# EAGLE design NoteBox (EAGLE 7.7.0)
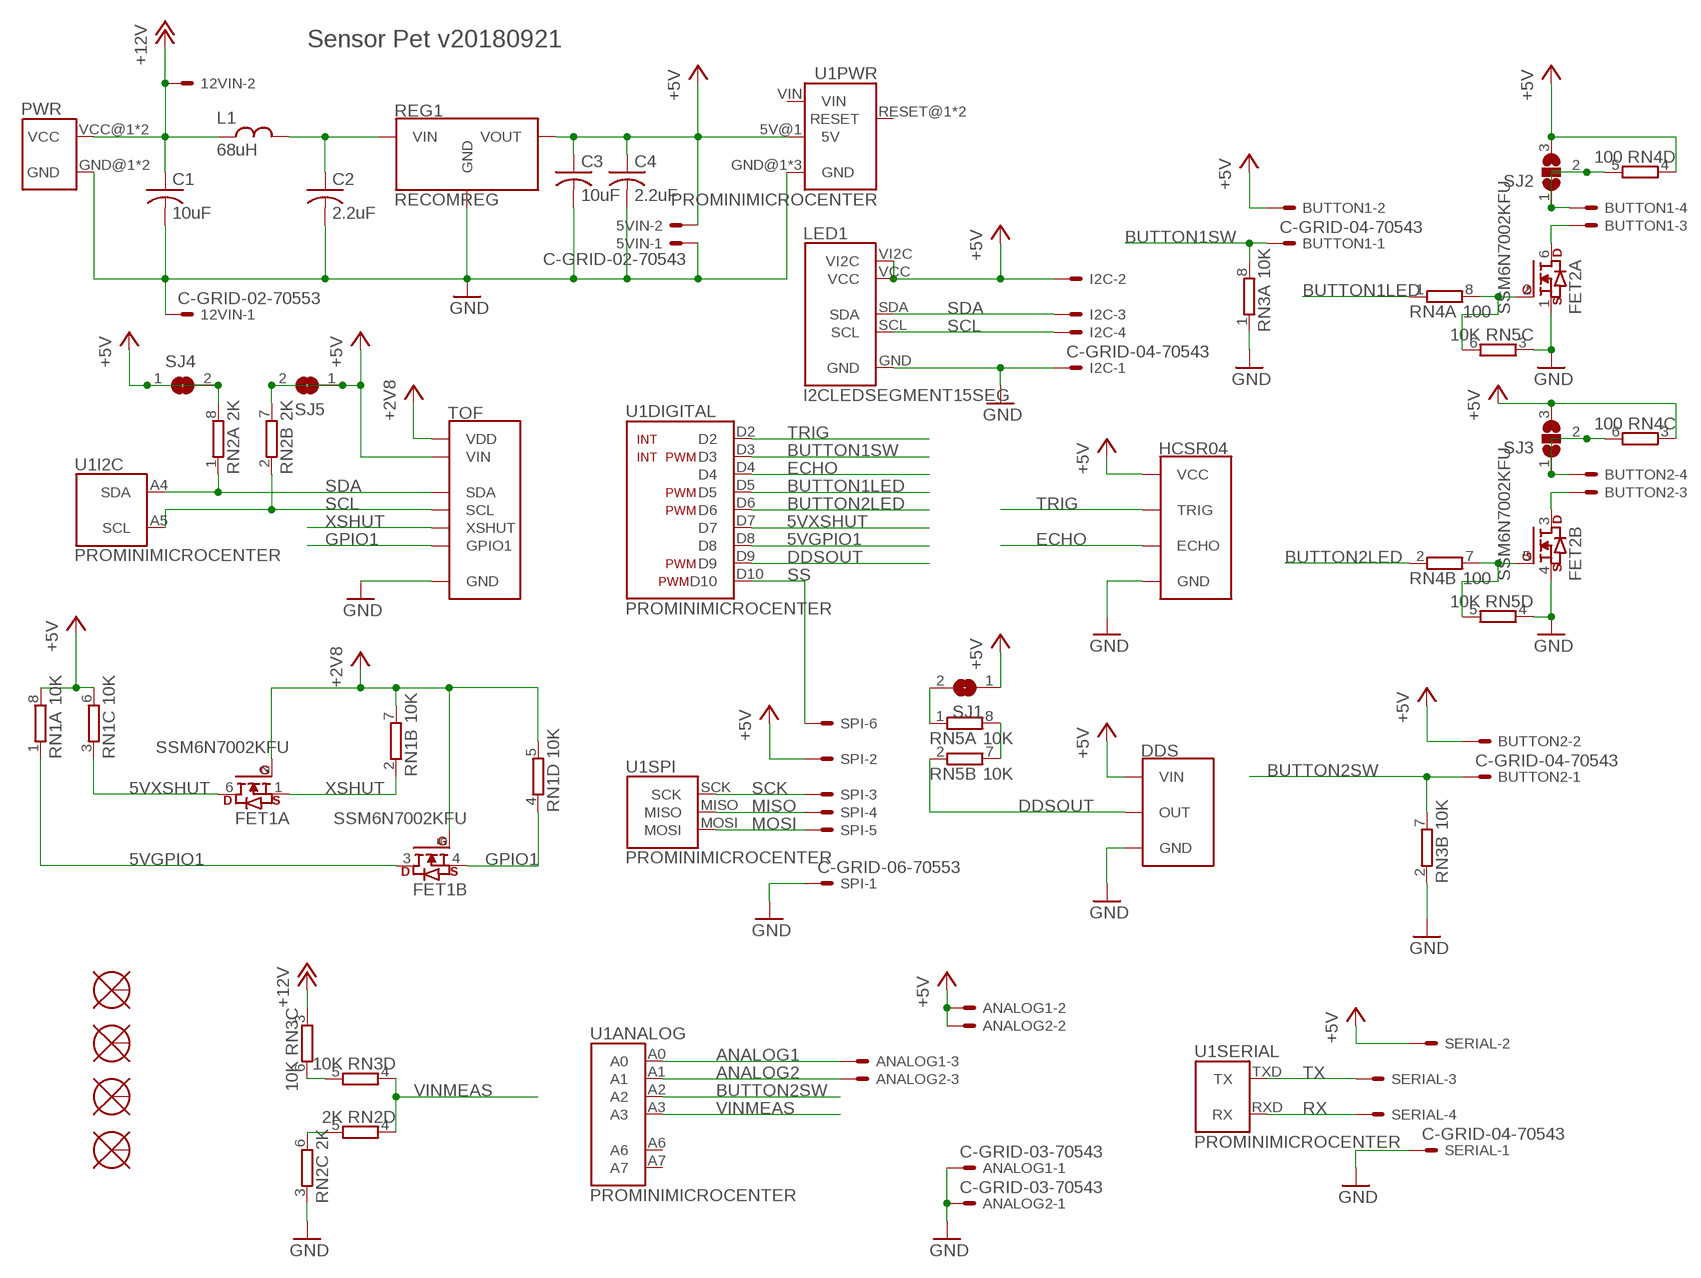
[diagram p0: schematic, sheet 1]

## Parts
5VIN  C-GRID-02-70543  [70543-02]
12VIN  C-GRID-02-70553  [70553-02]
ANALOG1  C-GRID-03-70543  [70543-03]
ANALOG2  C-GRID-03-70543  [70543-03]
BUTTON1  C-GRID-04-70543  [70543-04]
BUTTON2  C-GRID-04-70543  [70543-04]
C1  10uF  C-USC1206K  [C1206K]
C2  2.2uF  C-USC0805K  [C0805K]
C3  10uF  C-USC1206K  [C1206K]
C4  2.2uF  C-USC0805K  [C0805K]
DDS  POLOLUDDS  [POLOLUDDS]
FET1  SSM6N7002KFU  [US6]
FET2  SSM6N7002KFU  [US6]
HCSR04  HCSR04  [HCSR04]
I2C  C-GRID-04-70543  [70543-04]
L1  68uH  INDUCTOR  [6060]
LED1  I2CLEDSEGMENT15SEG  [ADAFRUITI2CLEDSEGMENT]
PWR  POWERPOLERA1X2  [PP-RA-1X2]
REG1  RECOMREG  [RECOMREG]
RN1  10K  4R-NCAY16  [CAY16]
RN2  2K  4R-NCAY16  [CAY16]
RN3  10K  4R-NCAY16  [CAY16]
RN4  100  4R-NCAY16  [CAY16]
RN5  10K  4R-NCAY16  [CAY16]
SERIAL  C-GRID-04-70543  [70543-04]
SJ1  SJ  [SJ]
SJ2  SJ2W  [SJ_2]
SJ3  SJ2W  [SJ_2]
SJ4  SJ  [SJ]
SJ5  SJ  [SJ]
SPI  C-GRID-06-70553  [70553-06]
TOF  POLOLUTOF  [POLOLUTOF]
U1  PROMINIMICROCENTER  [MICROCENTER-ARDUINO-PROMINI]
U$5  MOUNT6-32  [6-32]
U$6  MOUNT6-32  [6-32]
U$7  MOUNT6-32  [6-32]
U$8  MOUNT6-32  [6-32]

## Nets
5VGPIO1: FET1.3(B:D) RN1.1 U1.D8(DIGITAL:D8)
5VXSHUT: FET1.6(A:D) RN1.3 U1.D7(DIGITAL:D7)
+2V8: FET1.2(A:G) FET1.5(B:G) RN1.5 RN1.7 TOF.VDD
+5V: 5VIN.2 ANALOG1.2 ANALOG2.2 BUTTON1.2 BUTTON2.2 C3.1 C4.1 DDS.VIN HCSR04.VCC I2C.2 LED1.VCC LED1.VI2C REG1.3VOUT(VOUT) RN1.6 RN1.8 RN2.7 RN2.8 RN4.3 RN4.4 SERIAL.2 SJ1.1 SJ2.3 SJ3.3 SJ4.1 SJ4.2 SJ5.1 SJ5.2 SPI.2 TOF.VIN U1.5V@1(PWR:5V)
+12V: 12VIN.2 C1.1 L1.P$1 PWR.VCC@1(VCC) PWR.VCC@2(VCC) RN3.3
ANALOG1: ANALOG1.3 U1.A0(ANALOG:A0)
ANALOG2: ANALOG2.3 U1.A1(ANALOG:A1)
B1L+: BUTTON1.4 RN4.5 SJ2.1 SJ2.2
B1L-: BUTTON1.3 FET2.6(A:D)
B2L+: BUTTON2.4 RN4.6 SJ3.1 SJ3.2
B2L-: BUTTON2.3 FET2.3(B:D)
BUTTON1LED: RN4.1 U1.D5(DIGITAL:D5)
BUTTON1SW: BUTTON1.1 RN3.8 U1.D3(DIGITAL:D3)
BUTTON2LED: RN4.2 U1.D6(DIGITAL:D6)
BUTTON2SW: BUTTON2.1 RN3.7 U1.A2(ANALOG:A2)
DDSOUT: DDS.OUT RN5.2 U1.D9(DIGITAL:D9)
ECHO: HCSR04.ECHO U1.D4(DIGITAL:D4)
GND: 5VIN.1 12VIN.1 ANALOG1.1 ANALOG2.1 C1.2 C2.2 C3.2 C4.2 DDS.GND FET2.1(A:S) FET2.4(B:S) HCSR04.GND I2C.1 LED1.GND PWR.GND@1(GND) PWR.GND@2(GND) REG1.2GND(GND) RN2.3 RN3.1 RN3.2 RN5.3 RN5.4 SERIAL.1 SPI.1 TOF.GND U1.GND@1(PWR:GND) U1.GND@2(PWR:GND) U1.GND@3(PWR:GND)
GPIO1: FET1.4(B:S) RN1.4 TOF.GPIO(GPIO1)
MISO: SPI.4 U1.MISO(SPI:MISO)
MOSI: SPI.5 U1.MOSI(SPI:MOSI)
N$1: RN3.5 RN3.6
N$2: C2.1 L1.P$2 REG1.1VIN(VIN)
N$7: RN2.5 RN2.6
N$11: FET2.2(A:G) RN4.8 RN5.6
N$12: FET2.5(B:G) RN4.7 RN5.5
N$13: RN5.1 SJ1.2
N$14: RN5.7 RN5.8
RX: SERIAL.4 U1.RXD(SERIAL:RX)
SCK: SPI.3 U1.SCK(SPI:SCK)
SCL: I2C.4 LED1.SCL RN2.2 TOF.SCL U1.A5(I2C:SCL)
SDA: I2C.3 LED1.SDA RN2.1 TOF.SDA U1.A4(I2C:SDA)
SS: SPI.6 U1.D10(DIGITAL:D10)
TRIG: HCSR04.TRIG U1.D2(DIGITAL:D2)
TX: SERIAL.3 U1.TXD(SERIAL:TX)
VINMEAS: RN2.4 RN3.4 U1.A3(ANALOG:A3)
XSHUT: FET1.1(A:S) RN1.2 TOF.XSHUT
Unconnected: U1.A6(ANALOG:A6) U1.A7(ANALOG:A7) U1.RESET@1(PWR:RESET) U1.RESET@2(PWR:RESET) U$5.P$1 U$6.P$1 U$7.P$1 U$8.P$1

## Notes on the sheet
- Sensor Pet v20180921

## Power pins joined to a net without a drawn wire
VIN: U1.VIN(PWR:VIN)

## Library data of the parts
5VIN 12VIN = con-molex:C-GRID-02: CONNECTOR wire to board 2.54 mm (0.100") pitch header; OC_FARNELL: unknown; OC_NEWARK: unknown
ANALOG1 ANALOG2 = con-molex:C-GRID-03: CONNECTOR wire to board 2.54 mm (0.100") pitch header; OC_FARNELL: unknown; OC_NEWARK: unknown
BUTTON1 BUTTON2 I2C SERIAL = con-molex:C-GRID-04: CONNECTOR wire to board 2.54 mm (0.100") pitch header; OC_FARNELL: unknown; OC_NEWARK: unknown
C1-C4 = rcl:C-US: CAPACITOR, American symbol
DDS = LUR_Components:POLOLUDDS: Pololu Digital Distance Sensors GP2Y0D805 GP2Y0D810 GP2Y0D815
FET1 FET2 = LUR_Components:SSM6N7002KFU: SSM6N7002KFU Dual N Channel MOSFET SC88 US6 TSSOP-6 SOT-363
HCSR04 = LUR_Components:HCSR04: Traditional HC-SR04, HCSR04 sensor
L1 = LUR_Components:INDUCTOR: Murata Wirewound Shielded Inductor 1255AY-680M=P3
LED1 = UltrasonicHarp:I2CLEDSEGMENT: Adafruit I2C LED matrix breakouts Such as seven segment displays, 15 segment displays, etc.
PWR = Anderson:POWERPOLE: Anderson PowerPole Board Connector
REG1 = LUR_Components:RECOMREG: RECOM Switching Regulators R-78E-1.0
RN1-RN5 = resistor-dil:4R-N: Array Chip Resistor Source: RS Component / Phycomp; OC_FARNELL: unknown; OC_NEWARK: unknown
SJ1 SJ4 SJ5 = jumper:SJ: SMD solder JUMPER
SJ2 SJ3 = jumper:SJ2W: SMD solder JUMPER
SPI = con-molex:C-GRID-06: CONNECTOR wire to board 2.54 mm (0.100") pitch header; OC_FARNELL: unknown; OC_NEWARK: unknown
TOF = LUR_Components:POLOLUTOF: Pololu Time of Flight Sensors VL53L1X VL53L0X VL6180X
U1 = UltrasonicHarp:PROMINI: Arduino Pro-Mini
U$5-U$8 = Mounts:MOUNT

## Board
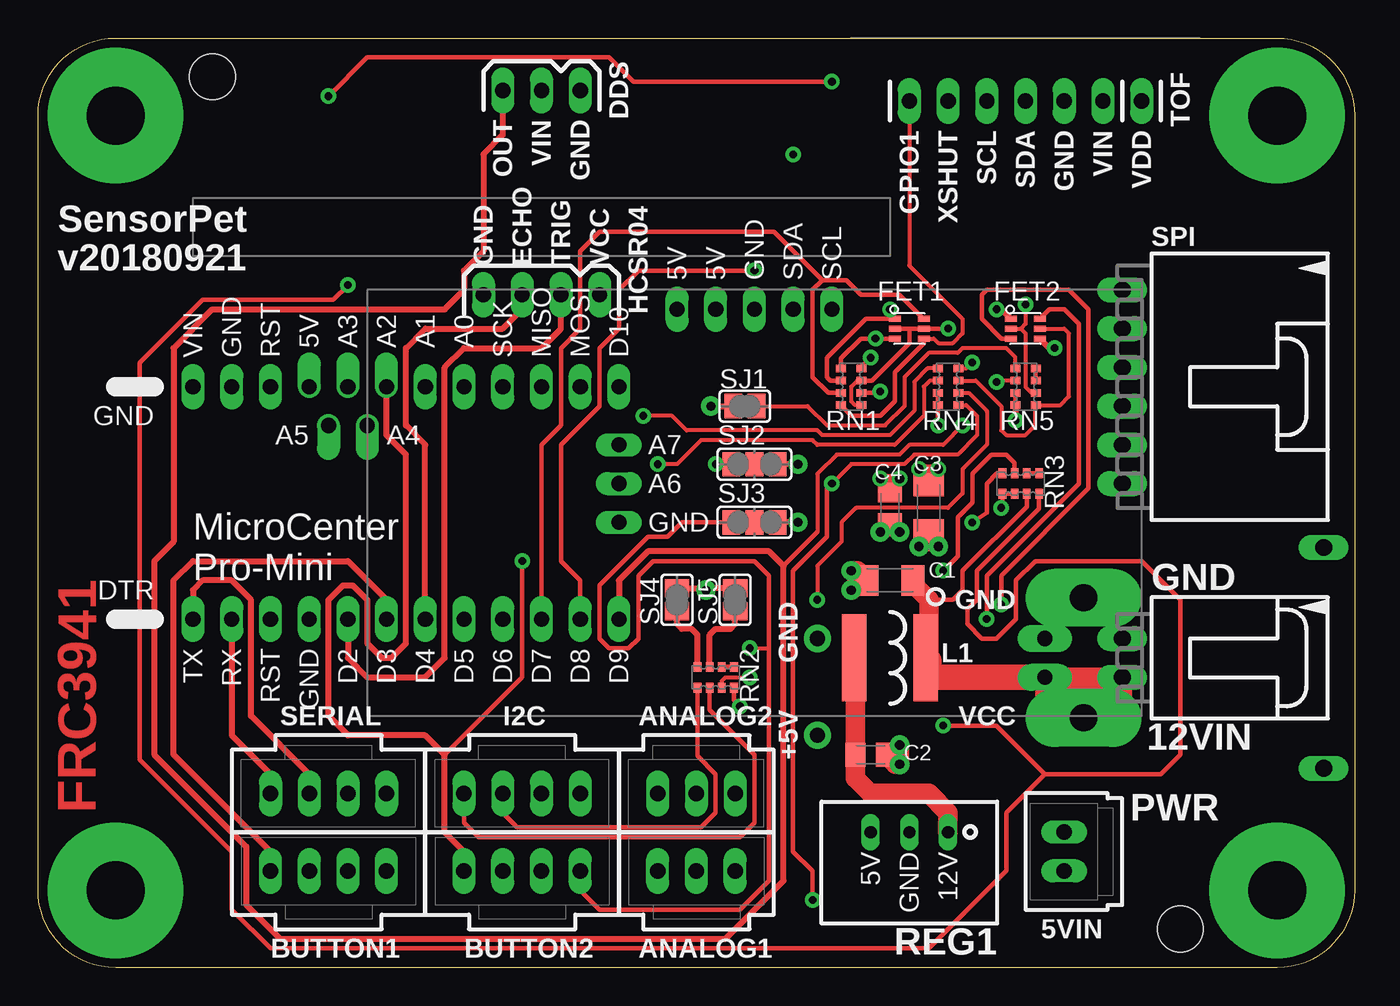
[diagram p1: board, top side]
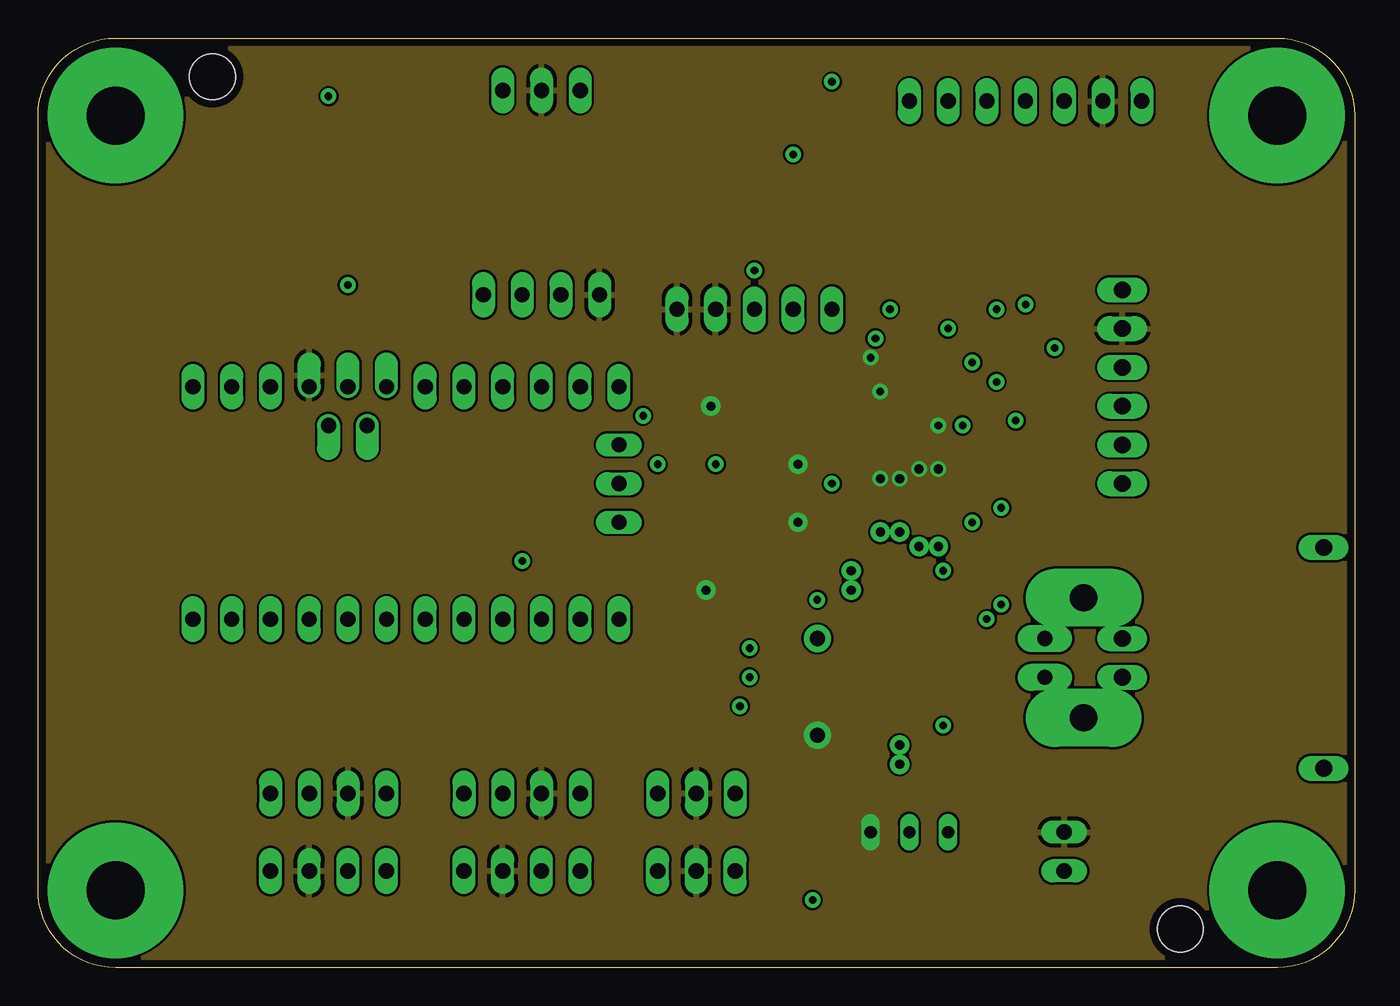
[diagram p2: board, inner layer Route2]
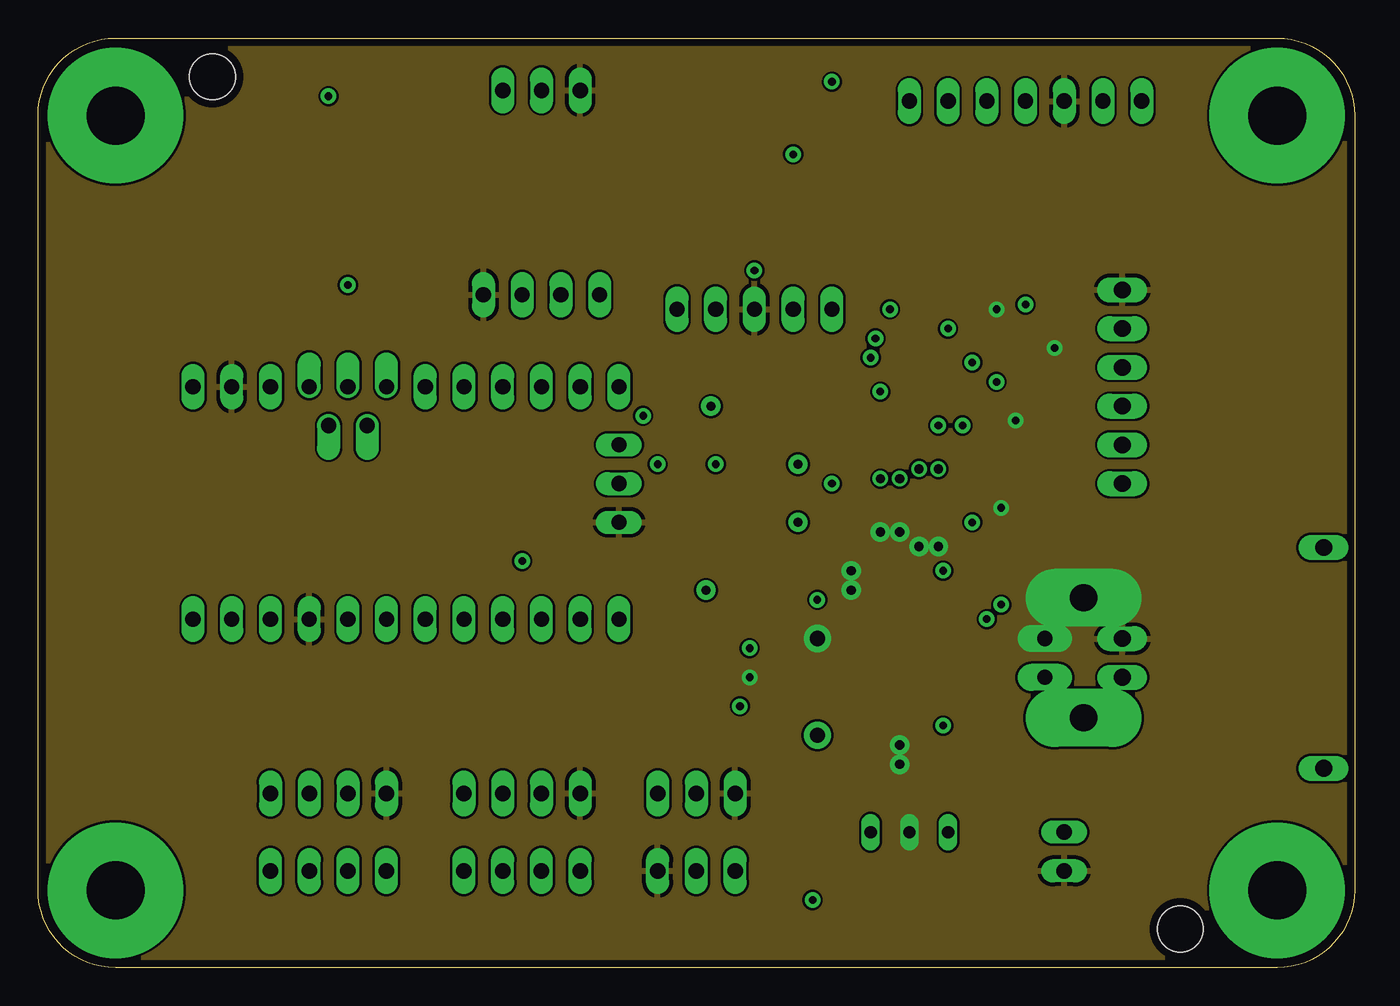
[diagram p3: board, inner layer Route15]
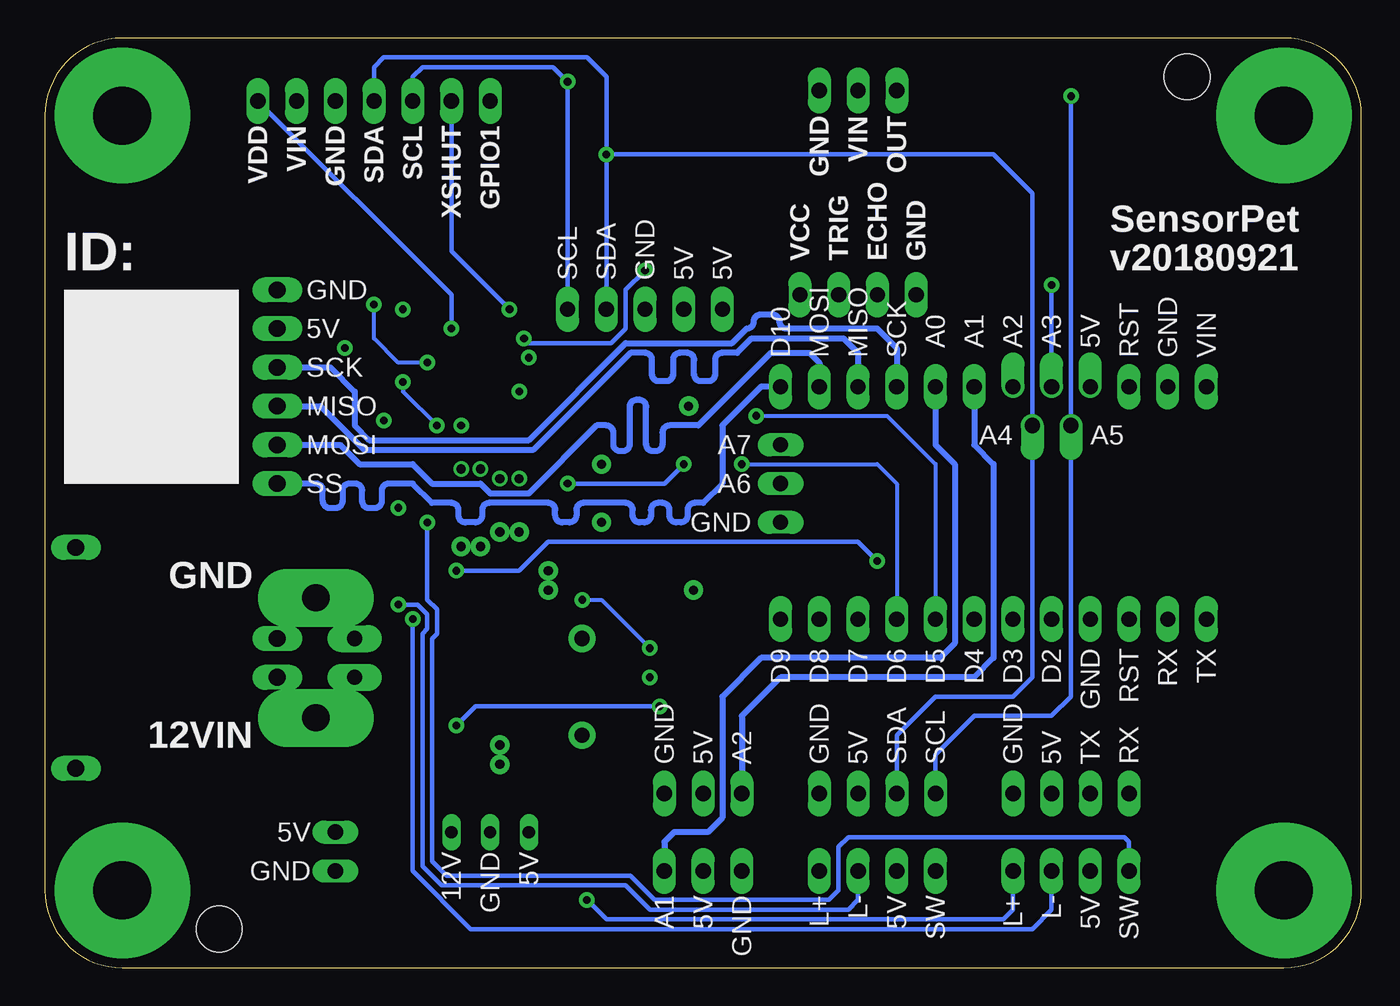
[diagram p4: board, bottom side, seen from below]

Size 86.36 x 60.96 mm. Coordinates in mm from the lower left corner, seen from the top.
Outline: 0,55.88 arc-90 5.08,60.96 81.28,60.96 arc-90 86.36,55.88 86.36,5.08 arc-90 81.28,0 5.08,0 arc-90 0,5.08 0,55.88
Copper layers (1*2*15*16): Top 0.035mm / dielectric 0.2mm / Route2 0.035mm / dielectric 1.2mm / Route15 0.035mm / dielectric 0.2mm / Bottom 0.035mm
Design rules "Elecrow_4-layer_PCB_eagle_rule": minimum track width 6mil, minimum drill 12mil, track to track 6mil, track to pad 6mil, pad to pad 6mil, via to via 8mil, smd to smd 0mil, copper to edge 20mil, drill to drill 10mil, minimum pad ring 6mil, minimum via ring 6mil, stop-mask expansion 0mil, vias tented up to drill 100mil, thermal gap 10mil
Holes 3 mm at 11.43,58.42 74.93,2.54

### Footprints (pad centres in the part's own frame; a part is rotated, then mirrored left to right if it is on the bottom)
70543-02 = drill 1.016 long: 1 -1.27,0; 2 1.27,0
70553-02 = drill 1.092 long: 1 -1.27,-7.62; 2 1.27,-7.62
70543-03 = drill 1.016 long: 1 -2.54,0; 2 0,0; 3 2.54,0
70543-04 = drill 1.016 long: 1 -3.81,0; 2 -1.27,0; 3 1.27,0; 4 3.81,0
C1206K = smd 1.5 x 2: 1 -1.5,0; 2 1.5,0
C0805K = smd 1.3 x 1.6: 1 -1,0; 2 1,0
POLOLUDDS = drill 1 long: GND -0.381,2.54; OUT -0.381,-2.54; VIN -0.381,0
US6 = smd 0.4 x 0.8: 1 -0.65,-0.95; 2 0,-0.95; 3 0.65,-0.95; 4 0.65,0.95; 5 0,0.95; 6 -0.65,0.95
HCSR04 = drill 1 long: ECHO 0.318,-1.27; GND 0.318,-3.81; TRIG 0.318,1.27; VCC 0.318,3.81
6060 = smd 1.6 x 5.7: P$1 -2.35,0; P$2 2.35,0
ADAFRUITI2CLEDSEGMENT = drill 1 long: GND -1.27,0; SCL 3.81,0; SDA 1.27,0; VCC -3.81,0; VI2C -6.35,0
PP-RA-1X2 = drill 1.778 pad 3.81 long: GND@1 0,-3.937; VCC@1 0,3.937 | drill 1 pad 1.778 long: GND@2 2.54,-1.27; VCC@2 2.54,1.27 | drill 1.1 long: STP@1 -15.748,7.239; STP@2 -15.748,-7.239
RECOMREG = drill 0.8 long: 1VIN -2.54,0; 2GND 0,0; 3VOUT 2.54,0
CAY16 = smd 0.5 x 0.65: 1 -1.2,-0.675; 2 -0.4,-0.675; 3 0.4,-0.675; 4 1.2,-0.675; 5 1.2,0.675; 6 0.4,0.675; 7 -0.4,0.675; 8 -1.2,0.675
SJ = smd 1.168 x 1.6: 1 -0.762,0; 2 0.762,0
SJ_2 = smd 1.168 x 1.6: 1 -1.524,0; 2 0,0; 3 1.524,0
70553-06 = drill 1.092 long: 1 -6.35,-7.62; 2 -3.81,-7.62; 3 -1.27,-7.62; 4 1.27,-7.62; 5 3.81,-7.62; 6 6.35,-7.62
POLOLUTOF = drill 1 long: GND 0.318,2.54; GPIO 0.318,-7.62; SCL 0.318,-2.54; SDA 0.318,0; VDD 0.318,7.62; VIN 0.318,5.08; XSHUT 0.318,-5.08
MICROCENTER-ARDUINO-PROMINI = drill 1 offset: 5V@1 -6.35,7.62; A2 -1.27,7.62; A3 -3.81,7.62; A4 -2.54,5.08; A5 -5.08,5.08 | drill 1 long: A0 3.81,7.62; A1 1.27,7.62; A6 13.97,1.27; A7 13.97,3.81; D2 -3.81,-7.62; D3 -1.27,-7.62; D4 1.27,-7.62; D5 3.81,-7.62; D6 6.35,-7.62; D7 8.89,-7.62; D8 11.43,-7.62; D9 13.97,-7.62; D10 13.97,7.62; GND@1 -11.43,7.62; GND@2 13.97,-1.27; GND@3 -6.35,-7.62; MISO 8.89,7.62; MOSI 11.43,7.62; RESET@1 -8.89,7.62; RESET@2 -8.89,-7.62; RXD -11.43,-7.62; SCK 6.35,7.62; TXD -13.97,-7.62; VIN -13.97,7.62
6-32 = drill 3.797 pad 8.89: P$1 0,0

### Placement (x,y rotation side)
5VIN  67.31,7.62 90 top
12VIN  78.74,20.32 270 top
ANALOG1  43.18,6.35 0 top
ANALOG2  43.18,11.43 180 top
BUTTON1  19.05,6.35 0 top
BUTTON2  31.75,6.35 0 top
C1  55.88,25.4 180 top
C2  54.61,13.97 0 top
C3  58.42,30.16 270 top
C4  55.88,30.16 270 top
DDS  33.02,57.15 270 top
FET1  57.15,41.91 270 top
FET2  64.77,41.91 270 top
HCSR04  33.02,44.45 270 top
I2C  31.75,11.43 180 top
L1  55.88,20.32 180 top
LED1  48.26,43.18 0 top
PWR  68.58,20.32 180 top
REG1  57.15,8.89 180 top
RN1  53.34,38.1 270 top
RN2  44.45,19.05 0 top
RN3  64.45,31.75 0 top
RN4  59.69,38.1 270 top
RN5  64.77,38.1 270 top
SERIAL  19.05,11.43 180 top
SJ1  46.35,36.83 0 top
SJ2  46.99,33.02 0 top
SJ3  46.99,29.21 0 top
SJ4  41.91,24.13 90 top
SJ5  45.72,24.13 90 top
SPI  78.74,38.1 270 top
TOF  64.77,57.15 270 top
U1  24.13,30.48 0 top
U$5  5.08,5.08 0 top
U$6  5.08,55.88 0 top
U$7  81.28,55.88 0 top
U$8  81.28,5.08 0 top

### Tracks (layer width: path | path; a pad name or v marks a point on that pad's centre or on a via)
5VGPIO1  (via drill 0.5 pad 1.02)
  Top 0.305: RN1.1 52.66,39.97 53.96,41.26 v54.93,41.26 FET1.3 | U1.D8 35.56,25.4 34.29,26.67 34.29,34.29 36.83,36.83 36.83,40.64 38.1,41.91 38.1,44.45 39.37,45.72 v46.99,45.72
  Bottom 0.305: v46.99,45.72 48.26,44.45 48.26,41.91 49.21,40.96 54.62,40.96 v54.93,41.26
5VXSHUT
  Top 0.305: FET1.6 58.09,42.56 56.52,44.13 53.98,44.13 53.02,45.09 51.44,45.09 | 51.44,45.09 50.8,44.45 50.8,38.73 51.84,37.7 RN1.3 | U1.D7 33.02,34.29 34.29,35.56 34.29,40.64 35.56,41.91 35.56,46.99 36.83,48.26 48.26,48.26 51.44,45.09
+2V8  (via drill 0.5 pad 1.02)
  Top 0.254: RN1.5 53.59,36.9 53.34,37.15 53.34,38.1 53.74,38.5 RN1.7
  Top 0.305: 57.15,41.91 FET1.5 v59.69,41.91 | 57.15,41.91 FET1.2 | RN1.7 54.69,38.5 57.15,40.96 57.15,41.91
  Bottom 0.305: TOF.VDD 59.69,44.13 v59.69,41.91
+5V  (via drill 0.5 pad 1.02, 0.6 pad 1.02, 0.6 pad 1.27, 1 pad 1.78)
  Top 0.305: RN1.8 54.02,39.41 v54.61,40.01 | RN1.6 55.16,37.7 v55.24,37.78 | RN4.4 RN4.3 59.02,36.47 v59.05,35.56
  Top 0.406: v44.13,36.83 SJ1.1 | v49.85,33.02 SJ2.3 | v49.85,29.21 SJ3.3 | RN2.8 43.25,21.84 42.86,22.23 42.23,22.23 41.91,22.54 SJ4.1 SJ4.2 43.69,24.89 v43.81,24.77 43.94,24.89 SJ5.2 SJ5.1 45.72,22.54 45.4,22.23 44.45,22.23 44.05,21.82 RN2.7
  Top 0.61: v55.24,32.07 v56.52,32.07 56.52,32.12 C4.1 | v59.05,32.7 v57.78,32.7 57.78,32.62 C3.1
  other vias: 51.12,15.24
  pour Route2: 0,60.96 86.36,60.96 86.36,0 0,0
+12V
  Top 0.305: 58.42,24.13 60.01,24.13 60.64,24.77 60.64,26.04 64.85,30.25 RN3.3
  Top 1.27: 12VIN.2 71.12,17.78 69.85,16.51 68.71,16.51 PWR.VCC@1 68.45,16.51 67.31,16.51 66.04,17.78 PWR.VCC@2 | PWR.VCC@2 67.31,19.05 68.58,17.78 69.85,19.05 12VIN.2 | 12VIN.2 PWR.VCC@2 | C1.1 57.38,25.17 58.42,24.13 58.42,20.51 L1.P$1
  Top 1.676: PWR.VCC@2 58.42,19.05 58.42,20.13 L1.P$1
ANALOG1
  Bottom 0.406: U1.A0 27.94,34.29 26.67,33.02 26.67,21.27 27.62,20.32 39.37,20.32 41.91,17.78 41.91,9.84 42.86,8.89 45.09,8.89 45.72,8.26 ANALOG1.3
ANALOG2
  Bottom 0.406: U1.A1 25.4,34.29 24.13,33.02 24.13,20.32 25.4,19.05 38.1,19.05 40.64,16.51 ANALOG2.3
B1L+  (via drill 0.5 pad 1.02)
  Top 0.254: RN4.5 60.89,36.9 61.59,36.2 61.59,34.92 60.33,33.66 57.47,33.66 56.83,33.02 53.34,33.02 v52.07,31.75
  Top 0.305: v50.8,4.45 50.8,6.35 49.53,7.62 49.53,26.04 51.75,28.26 51.75,31.43 v52.07,31.75 | v44.45,33.02 SJ2.1
  Top 0.406: SJ2.1 SJ2.2
  Bottom 0.305: BUTTON1.4 22.86,3.81 23.5,3.17 49.53,3.17 v50.8,4.45 | v52.07,31.75 45.72,31.75 v44.45,33.02
B1L-  (via drill 0.5 pad 1.02)
  Top 0.305: FET2.6 66.34,43.18 67.31,43.18 68.26,42.23 68.26,31.75 62.23,25.72 v62.23,22.86
  Bottom 0.305: v62.23,22.86 62.23,6.35 58.42,2.54 21.59,2.54 20.32,3.81 BUTTON1.3
B2L+  (via drill 0.5 pad 1.02)
  Top 0.254: RN4.6 61.04,37.7 62.23,36.51 62.23,34.29 60.64,32.7 60.64,31.11 59.69,30.16 53.66,30.16 52.7,29.21 52.7,27.94 51.12,26.35 v51.12,24.13 | v46.67,20.95 47.94,20.95
  Top 0.305: BUTTON2.4 35.56,5.08 36.83,3.81 46.04,3.81 47.94,5.71 47.94,20.95 47.94,25.72 46.99,26.67 40.32,26.67 39.37,25.72 39.37,21.59 38.73,20.95 37.47,20.95 36.83,21.59 36.83,25.08 40.01,28.26 41.27,28.26 42.23,29.21 SJ3.1
  Top 0.406: SJ3.1 SJ3.2
  Bottom 0.254: v51.12,24.13 49.85,24.13 v46.67,20.95
B2L-  (via drill 0.5 pad 1.02)
  Top 0.305: FET2.3 63.2,41.26 61.91,42.55 61.91,44.13 62.23,44.45 67.63,44.45 68.9,43.18 68.9,31.43 63.18,25.72 v63.18,23.81
  Bottom 0.305: v63.18,23.81 61.91,23.81 61.28,23.18 61.28,22.23 61.59,21.91 61.59,6.67 60.33,5.4 48.26,5.4 46.67,3.81 33.66,3.81 33.02,4.45 BUTTON2.3
BUTTON1LED  (via drill 0.5 pad 1.02)
  Top 0.254: RN4.1 58.35,39.3 57.47,38.42 57.47,36.51 55.88,34.92 51.44,34.92 51.12,35.24 42.55,35.24 41.59,36.2 v39.69,36.2
  Bottom 0.254: v39.69,36.2 31.11,36.2 27.94,33.02 U1.D5
BUTTON1SW  (via drill 0.5 pad 1.02)
  Top 0.305: RN3.8 62.91,32.42 62.23,31.75 62.23,29.84 v61.28,29.21
  Top 0.406: BUTTON1.1 15.24,7.62 8.89,13.97 8.89,25.4 10.16,26.67 20.32,26.67 22.86,24.13 U1.D3
  Bottom 0.305: v61.28,29.21 61.28,24.13 60.64,23.5 60.64,21.91 60.96,21.59 60.96,6.99 60.01,6.03 47.94,6.03 46.35,4.45 34.92,4.45 34.29,5.08 34.29,7.94 33.66,8.57 15.56,8.57 15.24,8.26 BUTTON1.1
BUTTON2LED  (via drill 0.5 pad 1.02)
  Top 0.254: RN4.2 58.5,38.5 58.1,38.1 58.1,36.2 56.2,34.29 51.12,34.29 50.8,34.61 43.5,34.61 41.91,33.02 v40.64,33.02
  Bottom 0.254: v40.64,33.02 31.75,33.02 30.48,31.75 U1.D6
BUTTON2SW  (via drill 0.5 pad 1.02)
  Top 0.305: RN3.7 64.05,33.1 63.5,33.66 62.55,33.66 61.28,32.38 61.28,30.48 60.33,29.53 60.33,26.99 v59.37,26.04 | v31.75,26.67 31.75,19.05 26.67,13.97
  Top 0.406: BUTTON2.1 27.94,7.62 26.67,8.89 26.67,13.97 25.4,15.24 20.32,15.24 19.05,16.51 19.05,24.13 20,25.08 20.64,25.08 21.59,24.13 21.59,21.27 22.54,20.32 23.18,20.32 24.13,21.27 24.13,33.66 22.86,34.92 U1.A2
  Bottom 0.305: v59.37,26.04 55.24,26.04 53.34,27.94 33.02,27.94 v31.75,26.67
DDSOUT  (via drill 0.5 pad 1.02)
  Top 0.254: RN5.2 62.95,38.5 v62.87,38.42 | v60.64,35.56 59.37,34.29 57.15,34.29 56.52,33.66 52.39,33.66 51.12,32.38 51.12,28.57
  Top 0.305: 51.12,28.57 48.9,26.35
  Top 0.406: DDS.OUT 30.48,54.61 29.21,53.34 29.21,46.99 27.94,45.72 27.94,44.45 26.67,43.18 11.43,43.18 8.89,40.64 8.89,27.94 7.62,26.67 7.62,13.97 13.65,7.94 13.65,4.13 15.88,1.91 45.09,1.91 48.9,5.71 48.9,26.35 47.94,27.3 40.01,27.3 38.1,25.4 U1.D9
  Bottom 0.254: v62.87,38.42 62.87,37.78 v60.64,35.56
ECHO
  Top 0.406: U1.D4 25.4,34.29 24.13,35.56 24.13,40.64 25.4,41.91 30.48,41.91 31.75,43.18 HCSR04.ECHO
GND  (via drill 0.5 pad 1.02, 0.6 pad 1.27, 1 pad 1.78)
  Top 0.254: RN2.3 44.85,18.82 45.09,19.05 v46.67,19.05
  Top 0.305: RN3.2 RN3.1 63.25,30.41 v63.18,30.16 | RN5.3 RN5.4
  Top 0.406: FET2.1 63.2,43.18 v62.87,43.18 | FET2.4 66.34,40.64 v66.67,40.64 | RN5.4 64.09,35.92 v64.14,35.88
  Top 0.61: v59.05,27.62 v57.78,27.62 57.78,28.34 C3.2 | v56.52,28.57 v55.24,28.57 55.24,28.84 C4.2
  Top 1.27: v53.34,26.04 53.74,26.04 | 53.74,26.04 C1.2 | 53.74,26.04 53.74,25.17 v53.34,24.77 53.98,25.4 | v56.52,14.61 v56.52,13.34 56.24,13.34 C2.2
  other vias: 51.12,21.59
  pour Route15: 0,60.96 86.36,60.96 86.36,0 0,0
GPIO1
  Top 0.254: TOF.GPIO 57.15,46.04 60.64,42.55 60.64,41.59 60.01,40.96 59.05,40.96 58.75,41.26 FET1.4
  Top 0.305: RN1.4 52.98,36.55 53.34,36.2 55.24,36.2 56.2,37.15 56.2,39.05 58.1,40.95 FET1.4
MISO
  Bottom 0.406: SPI.4 68.26,36.83 65.41,33.97 54.29,33.97 47.94,40.32 46.99,40.32 arc90 46.53,39.87 46.53,38.92 arc-90 46.08,38.46 45.61,38.46 arc-90 45.15,38.92 45.15,39.87 arc90 44.7,40.32 44.23,40.32 arc90 43.77,39.87 43.77,38.92 arc-90 43.32,38.46 42.85,38.46 arc-90 42.4,38.92 42.4,39.87 arc90 41.94,40.32 40.96,40.32 40.01,41.27 33.97,41.27 33.02,40.32 U1.MISO
MOSI
  Bottom 0.406: SPI.5 66.99,34.29 65.72,33.02 62.23,33.02 60.96,31.75 57.78,31.75 57.15,31.11 54.61,31.11 50.16,35.56 49.53,35.56 arc90 49.07,35.1 49.07,34.34 arc-90 48.62,33.88 48.45,33.88 arc-90 48,34.34 48,36.78 arc90 47.54,37.24 47.38,37.24 arc90 46.92,36.78 46.92,34.34 arc-90 46.46,33.88 46.3,33.88 arc-90 45.84,34.34 45.84,35.1 arc90 45.39,35.56 43.5,35.56 38.73,40.32 36.2,40.32 35.56,39.69 U1.MOSI
N$1
  Top 0.305: RN3.5 RN3.6
N$2
  Top 1.27: L1.P$2 53.61,20.24 C2.1 53.61,12.43 54.61,11.43 58.42,11.43 59.69,10.16 REG1.1VIN
N$7
  Top 0.254: RN2.5 RN2.6
N$11  (via drill 0.5 pad 1.02)
  Top 0.254: FET2.2 64.45,41.91 | 64.45,41.91 64.77,41.59 64.77,38.1 65.17,37.7 RN5.6 | RN4.8 60.89,39.3 v61.28,39.69 | v64.77,43.5 64.77,42.23 64.45,41.91
  Bottom 0.254: v61.28,39.69 63.18,39.69 64.77,41.27 v64.77,43.5
N$12
  Top 0.254: FET2.5 67.31,41.91 67.63,41.59 67.63,37.47 67.06,36.9 RN5.5 65.41,36.86 65.41,35.56 64.77,34.92 63.5,34.92 63.18,35.24 63.18,36.83 61.51,38.5 RN4.7
N$13
  Top 0.254: RN5.1 64.09,40.05 63.5,40.64 60.64,40.64 60.33,40.32 58.42,40.32 56.83,38.73 56.83,36.83 55.56,35.56 51.75,35.56 50.48,36.83 SJ1.2
N$14
  Top 0.254: RN5.7 RN5.8
RX
  Top 0.406: U1.RXD 12.7,15.24 15.24,12.7 SERIAL.4
SCK
  Bottom 0.406: SPI.3 67.63,39.37 66.04,37.78 66.04,35.56 65.09,34.61 54.61,34.61 48.26,40.96 41.27,40.96 40.32,41.91 arc-90 39.87,42.37 arc90 39.41,42.82 38.63,42.82 arc90 38.17,42.37 arc-90 37.71,41.91 31.75,41.91 30.48,40.64 U1.SCK
SCL  (via drill 0.5 pad 1.02)
  Top 0.305: RN2.2 44.05,16.91 46.99,13.97 46.99,9.53 46.04,8.57 28.89,8.57 27.94,9.53 I2C.4 | v52.07,58.1 39.05,58.1 37.47,59.69 21.59,59.69 v19.05,57.15
  Bottom 0.305: I2C.4 27.94,13.97 25.4,16.51 20.32,16.51 19.05,17.78 U1.A5 19.05,50.8 v19.05,57.15 | TOF.SCL 62.23,58.42 61.59,59.05 53.02,59.05 v52.07,58.1 LED1.SCL
SDA  (via drill 0.5 pad 1.02)
  Top 0.305: RN2.1 43.25,13.9 44.45,12.7 44.45,10.16 43.5,9.21 31.43,9.21 30.48,10.16 I2C.3
  Bottom 0.305: I2C.3 30.48,15.24 27.94,17.78 22.86,17.78 21.59,19.05 U1.A4 21.59,50.8 24.13,53.34 v49.53,53.34 | TOF.SDA 64.77,59.05 64.14,59.69 50.8,59.69 49.53,58.42 v49.53,53.34 | v49.53,53.34 LED1.SDA
SS
  Bottom 0.406: U1.D10 39.37,38.1 41.91,35.56 41.91,31.75 43.18,30.48 43.73,30.48 arc-90 44.19,30.02 44.19,29.67 arc90 44.65,29.21 44.94,29.21 arc90 45.4,29.67 45.4,30.02 arc-90 45.85,30.48 46.14,30.48 arc-90 46.6,30.02 46.6,29.67 arc90 47.06,29.21 47.35,29.21 arc90 47.8,29.67 47.8,30.02 arc-90 48.26,30.48 51.04,30.48 arc-90 51.5,30.02 51.5,29.67 arc90 51.95,29.21 52.43,29.21 arc90 52.88,29.67 52.88,30.02 arc-90 53.34,30.48 57.21,30.48 arc-90 57.67,30.02 57.67,29.67 arc90 58.13,29.21 58.78,29.21 arc90 59.23,29.67 59.23,30.02 arc-90 59.69,30.48 60.96,30.48 62.23,31.75 63.8,31.75 arc-90 64.26,31.29 64.26,30.6 arc90 64.72,30.15 65.09,30.15 arc90 65.55,30.6 65.55,31.29 arc-90 66,31.75 66.38,31.75 arc-90 66.83,31.29 66.83,30.6 arc90 67.29,30.15 67.67,30.15 arc90 68.12,30.6 68.12,31.29 arc-90 68.58,31.75 SPI.6
TRIG
  Top 0.406: U1.D2 20.32,20.32 21.59,19.05 25.4,19.05 26.67,20.32 26.67,39.37 27.94,40.64 33.02,40.64 34.29,41.91 HCSR04.TRIG
TX
  Top 0.406: SERIAL.3 17.78,12.7 13.97,16.51 13.97,24.13 12.7,25.4 10.79,25.4 10.16,24.77 U1.TXD
VINMEAS  (via drill 0.5 pad 1.02)
  Top 0.305: RN3.4 65.65,30.09 61.59,26.04 61.59,24.13 60.96,23.5 60.96,22.54 61.91,21.59 62.87,21.59 64.14,22.86 64.14,25.4 65.41,26.67 72.39,26.67 74.93,24.13 74.93,13.97 73.66,12.7 66.04,12.7 | 66.04,12.7 63.5,10.16 63.5,6.35 58.42,1.27 15.24,1.27 12.7,3.81 12.7,7.62 6.67,13.65 6.67,39.69 10.79,43.81 19.37,43.81 v20.32,44.77 | RN2.4 45.65,17.53 v46.04,17.14 | v59.37,15.88 62.87,15.88 66.04,12.7
  Bottom 0.305: v20.32,44.77 U1.A3 | v46.04,17.14 58.1,17.14 v59.37,15.88
XSHUT  (via drill 0.5 pad 1.02)
  Top 0.305: v55.88,43.18 55.88,42.88 FET1.1 54.31,42.56 51.75,40.01 51.75,38.73 51.99,38.5 RN1.2
  Bottom 0.305: v55.88,43.18 59.69,46.99 TOF.XSHUT

### Text on the board
Top: FRC3941
tPlace: GND | GND | +5V
bPlace: ID: | GND | 12VIN
tNames: SensorPet | v20180921 | 5V | 5V | GND | SDA | SCL | 5V | GND | 12V
bNames: SensorPet | v20180921 | 5V | 5V | GND | SDA | SCL | GND | 5V | SCK | MISO | MOSI | SS | RX | TX | 5V | GND | SCL | SDA | 5V | GND | A2 | 5V | GND | 5V | 5V | GND | 12V | GND | SW | 5V | L- | L+ | SW | 5V | L- | L+ | GND | 5V | A1